# Altium schematic sheet VISHIPEL_ver1.0.SchDoc: mach_mau
size 594 x 420 mm; Author: thaipham; SheetNumber: 1; SheetTotal: 1
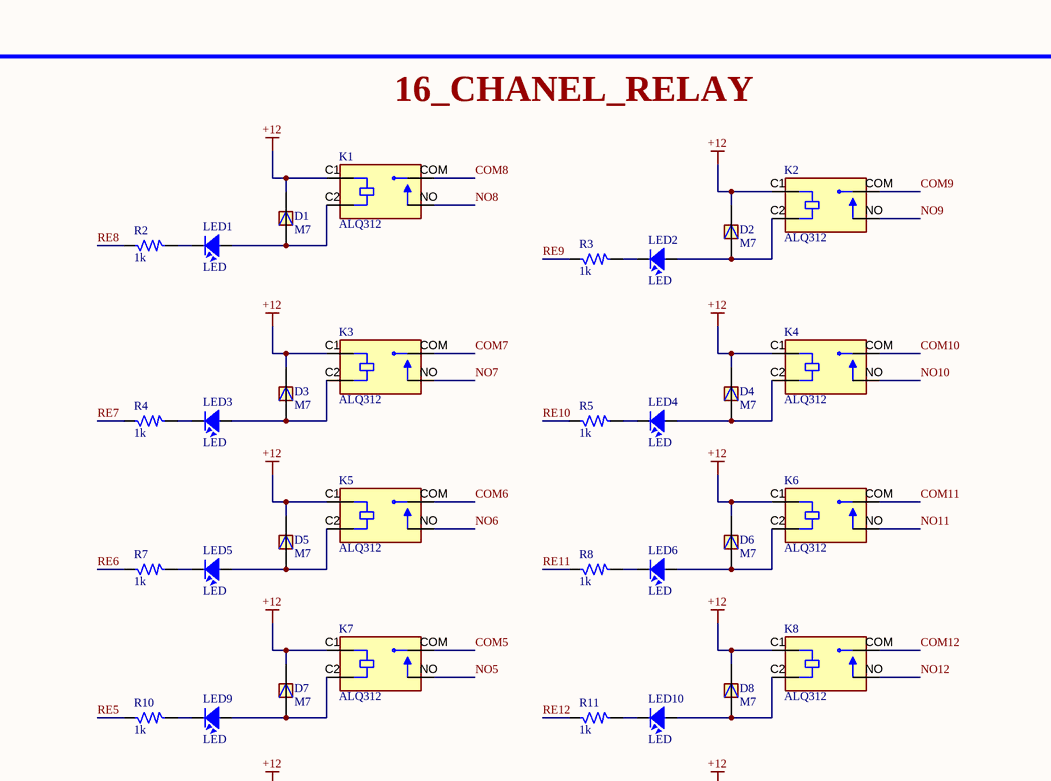
[diagram p0: VISHIPEL_ver1.0.SchDoc, top left]
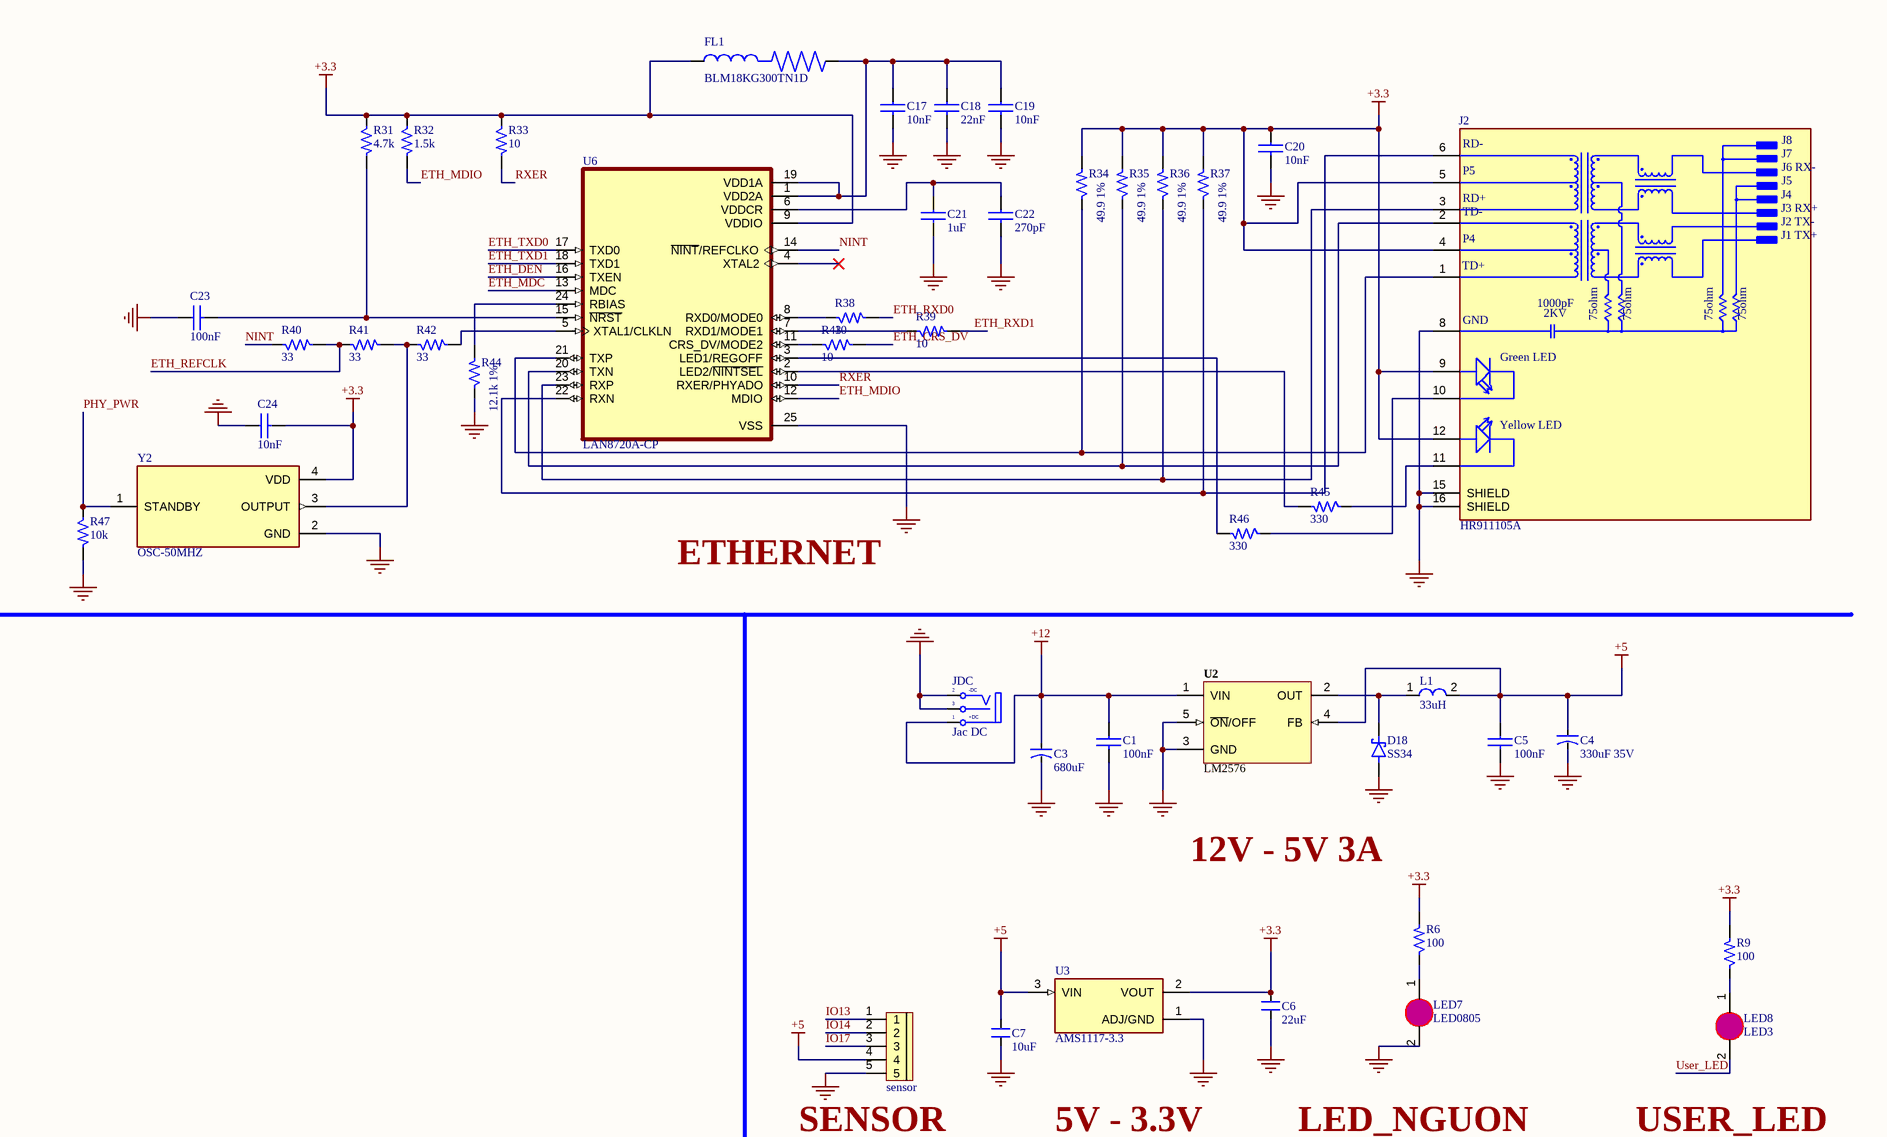
[diagram p1: VISHIPEL_ver1.0.SchDoc, top right]
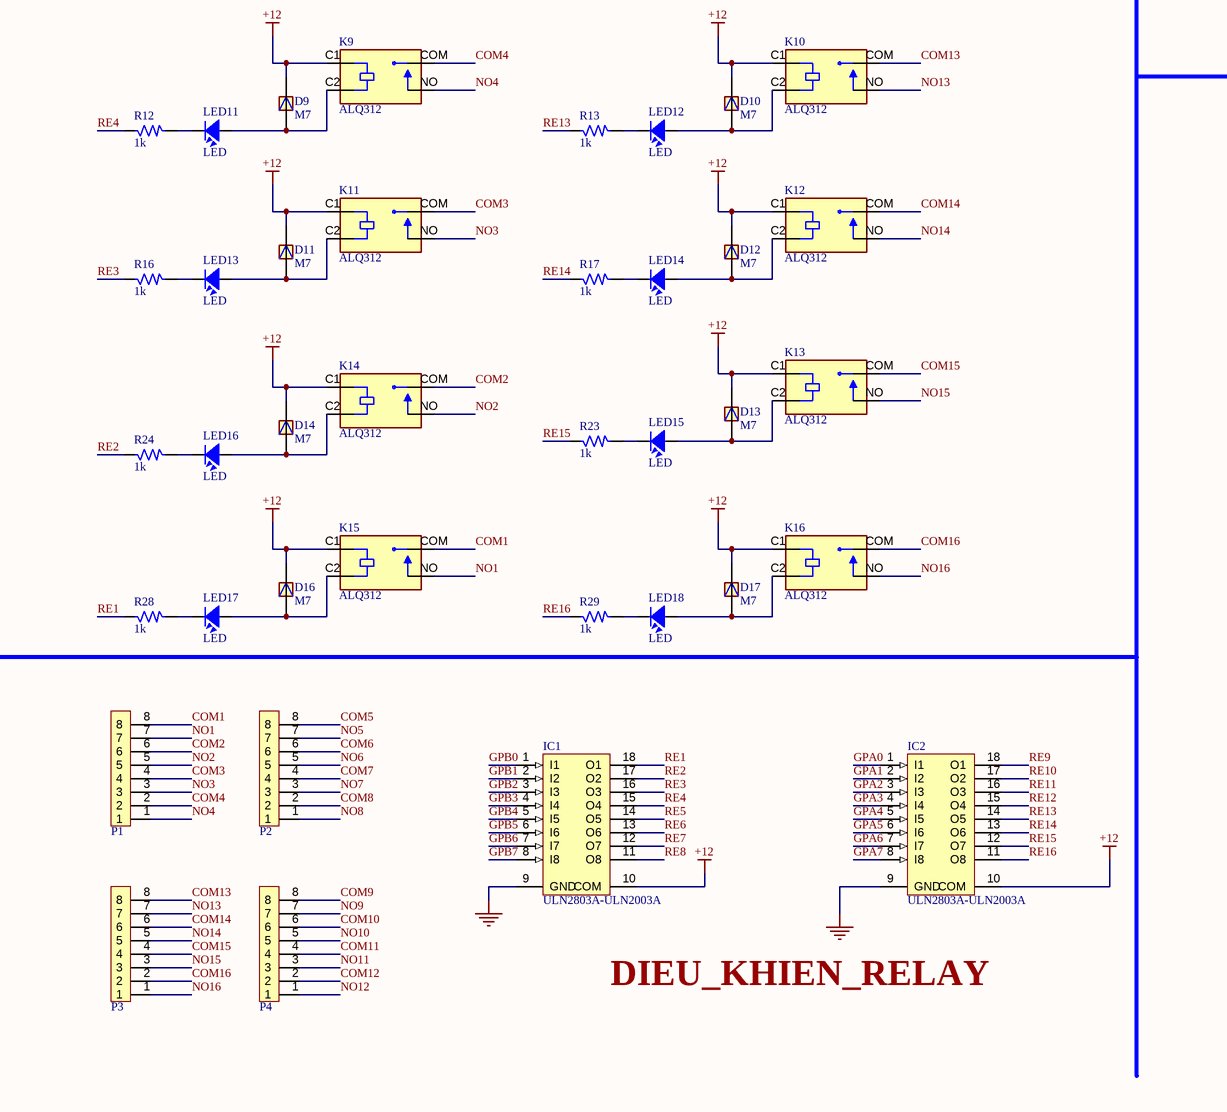
[diagram p2: VISHIPEL_ver1.0.SchDoc, bottom left]
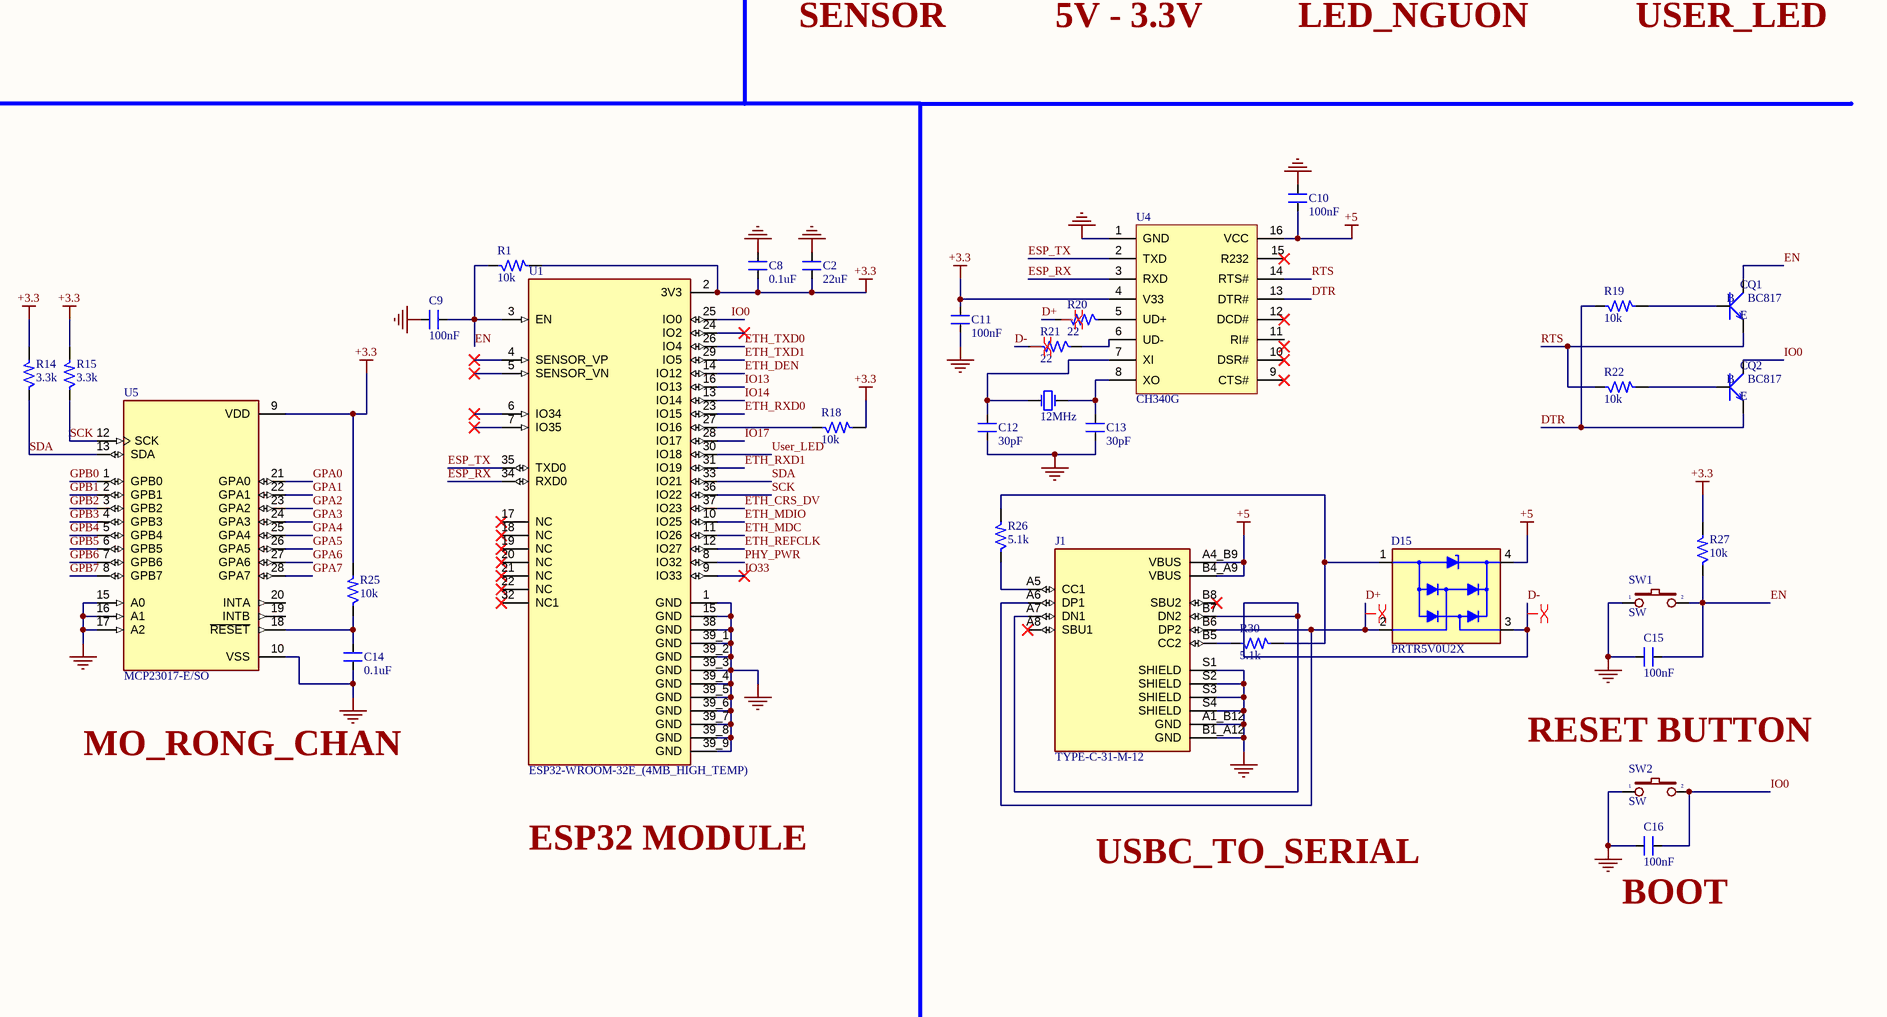
[diagram p3: VISHIPEL_ver1.0.SchDoc, bottom right]

## Parts
C1  100nF  [0805]
C2  22uF  [SM-0805]
C3  680uF  [CA-ALU-2.54]
C4  330uF 35V  [CA-ALU-2.54]
C5  100nF  [0805]
C6  22uF  [SM-0805]
C7  10uF  [SM-0805]
C8  0.1uF  [SM-0805]
C9  100nF  [SM-0805]
C10  100nF  [SM-0805]
C11  100nF  [SM-0805]
C12  30pF  [SM-0805]
C13  30pF  [SM-0805]
C14  0.1uF  [SM-0805]
C15  100nF  [SM-0805]
C16  100nF  [SM-0805]
C17  10nF  [0805]
C18  22nF  [0805]
C19  10nF  [0805]
C20  10nF  [0805]
C21  1uF  [0805]
C22  270pF  [0805]
C23  100nF  [0805]
C24  10nF  [0805]
D1  M7  [DIOM505270X240]
D2  M7  [DIOM505270X240]
D3  M7  [DIOM505270X240]
D4  M7  [DIOM505270X240]
D5  M7  [DIOM505270X240]
D6  M7  [DIOM505270X240]
D7  M7  [DIOM505270X240]
D8  M7  [DIOM505270X240]
D9  M7  [DIOM505270X240]
D10  M7  [DIOM505270X240]
D11  M7  [DIOM505270X240]
D12  M7  [DIOM505270X240]
D13  M7  [DIOM505270X240]
D14  M7  [DIOM505270X240]
D15  PRTR5V0U2X  [SOT190P230X110-4N]
D16  M7  [DIOM505270X240]
D17  M7  [DIOM505270X240]
D18  SS34  [DIOM7959X265N]
FL1  BLM18KG300TN1D  [BEADC1608X75N]
IC1  ULN2803A-ULN2003A  [SO-G16/X.6]
IC2  ULN2803A-ULN2003A  [SO-G16/X.6]
J1  TYPE-C-31-M-12  [HRO_TYPE-C-31-M-12]
J2  HR911105A  [HANRUN_HR911105A]
JDC  Jac DC  [DC-IN]
K1  ALQ312  [RELAY_ALQ312]
K2  ALQ312  [RELAY_ALQ312]
K3  ALQ312  [RELAY_ALQ312]
K4  ALQ312  [RELAY_ALQ312]
K5  ALQ312  [RELAY_ALQ312]
K6  ALQ312  [RELAY_ALQ312]
K7  ALQ312  [RELAY_ALQ312]
K8  ALQ312  [RELAY_ALQ312]
K9  ALQ312  [RELAY_ALQ312]
K10  ALQ312  [RELAY_ALQ312]
K11  ALQ312  [RELAY_ALQ312]
K12  ALQ312  [RELAY_ALQ312]
K13  ALQ312  [RELAY_ALQ312]
K14  ALQ312  [RELAY_ALQ312]
K15  ALQ312  [RELAY_ALQ312]
K16  ALQ312  [RELAY_ALQ312]
L1  33uH  [L-SMD-M-7.3x4.5]
LED1  LED  [LED-3]
LED2  LED  [LED-3]
LED3  LED  [LED-3]
LED4  LED  [LED-3]
LED5  LED  [LED-3]
LED6  LED  [LED-3]
LED7  LED0805  [LED0805]
LED8  LED3  [LED0805]
LED9  LED  [LED-3]
LED10  LED  [LED-3]
LED11  LED  [LED-3]
LED12  LED  [LED-3]
LED13  LED  [LED-3]
LED14  LED  [LED-3]
LED15  LED  [LED-3]
LED16  LED  [LED-3]
LED17  LED  [LED-3]
LED18  LED  [LED-3]
P1  BIG Heager 8  [BIG_Header 8]  (value not drawn)
P2  BIG Heager 8  [BIG_Header 8]  (value not drawn)
P3  BIG Heager 8  [BIG_Header 8]  (value not drawn)
P4  BIG Heager 8  [BIG_Header 8]  (value not drawn)
Q1  BC817  [SOT-23]
Q2  BC817  [SOT-23]
R1  10k  [SM-1206]
R2  1k  [SM-1206]
R3  1k  [SM-1206]
R4  1k  [SM-1206]
R5  1k  [SM-1206]
R6  100  [SM-1206]
R7  1k  [SM-1206]
R8  1k  [SM-1206]
R9  100  [SM-1206]
R10  1k  [SM-1206]
R11  1k  [SM-1206]
R12  1k  [SM-1206]
R13  1k  [SM-1206]
R14  3.3k  [SM-1206]
R15  3.3k  [SM-1206]
R16  1k  [SM-1206]
R17  1k  [SM-1206]
R18  10k  [SM-1206]
R19  10k  [SM-1206]
R20  22  [SM-1206]
R21  22  [SM-1206]
R22  10k  [SM-1206]
R23  1k  [SM-1206]
R24  1k  [SM-1206]
R25  10k  [SM-1206]
R26  5.1k  [SM-1206]
R27  10k  [SM-1206]
R28  1k  [SM-1206]
R29  1k  [SM-1206]
R30  5.1k  [SM-1206]
R31  4.7k  [SM-1206]
R32  1.5k  [SM-1206]
R33  10  [SM-1206]
R34  49.9 1%  [SM-1206]
R35  49.9 1%  [SM-1206]
R36  49.9 1%  [SM-1206]
R37  49.9 1%  [SM-1206]
R38  10  [SM-1206]
R39  10  [SM-1206]
R40  33  [SM-1206]
R41  33  [SM-1206]
R42  33  [SM-1206]
R43  10  [SM-1206]
R44  12.1k 1%  [SM-1206]
R45  330  [SM-1206]
R46  330  [SM-1206]
R47  10k  [SM-1206]
sensor  BIG Header 4  [BIG_Header 5]  (value not drawn)
SW1  SW  [SW2]
SW2  SW  [SW2]
U1  ESP32-WROOM-32E_(4MB_HIGH_TEMP)  [XCVR_ESP32-WROOM-32E_(4MB_HIGH_TEMP)]
U2  LM2576  [TO263]
U3  AMS1117-3.3  [SOT229P700X180-4N]
U4  CH340G  [SO-16]
U5  MCP23017-E/SO  [SOIC127P1030X265-28N]
U6  LAN8720A-CP  [QFN50P400X400X100-25N]
Y1  12MHz  [XT2]
Y2  OSC-50MHZ  [XTAL_ASEM1-50.000MHZ-LC-T]

## Nets
+3.3: C2.2 C6.2 C8.2 C11.2 C20.1 C24.2 FL1.1 J2.4(P4) J2.5(P5) J2.9(GA) J2.12(YA) R1.2 R6.2 R9.2 R14.2 R15.2 R18.2 R25.2 R27.2 R31.1 R32.1 R33.1 R34.2 R35.2 R36.2 R37.2 U1.2(3V3) U3.2(VOUT) U4.4(V33) U5.9(VDD) U6.9(VDDIO) Y2.4(VDD)
+5: C4.1 C5.1 C7.2 C10.2 D15.4(VCC) J1.A4_B9(VBUS) J1.B4_A9(VBUS) L1.2 sensor.4 U2.4(FB) U3.3(VIN) U4.16(VCC)
+12: C1.1 C3.1 D1.C D2.C D3.C D4.C D5.C D6.C D7.C D8.C D9.C D10.C D11.C D12.C D13.C D14.C D16.C D17.C IC1.10(COM) IC2.10(COM) JDC.1(T) K1.C1(COIL1) K2.C1(COIL1) K3.C1(COIL1) K4.C1(COIL1) K5.C1(COIL1) K6.C1(COIL1) K7.C1(COIL1) K8.C1(COIL1) K9.C1(COIL1) K10.C1(COIL1) K11.C1(COIL1) K12.C1(COIL1) K13.C1(COIL1) K14.C1(COIL1) K15.C1(COIL1) K16.C1(COIL1) U2.1(VIN)
GND: C1.2 C2.1 C3.2 C4.2 C5.2 C6.1 C7.1 C8.1 C9.1 C10.1 C11.1 C12.1 C13.1 C14.1 C15.1 C16.1 C17.2 C18.2 C19.2 C20.2 C21.2 C22.2 C23.1 C24.1 D18.A J1.A1_B12(GND) J1.B1_A12(GND) J1.S1(SHIELD) J1.S2(SHIELD) J1.S3(SHIELD) J1.S4(SHIELD) J2.8(GND) J2.15(SHIELD) J2.16(SHIELD) JDC.2(TN) JDC.3(S) LED7.2(K) R44.1 R47.2 sensor.5 SW1.1 SW2.1 U1.1(GND) U1.15(GND) U1.38(GND) U1.39_1(GND) U1.39_2(GND) U1.39_3(GND) U1.39_4(GND) U1.39_5(GND) U1.39_6(GND) U1.39_7(GND) U1.39_8(GND) U1.39_9(GND) U2.3(GND) U2.5(~{ON}/OFF) U3.1(ADJ/GND) U4.1(GND) U5.10(VSS) U5.15(A0) U5.16(A1) U5.17(A2) U6.25(VSS) Y2.2(GND)
NetIC1_9: IC1.9(GND) IC2.9(GND)
COM1: K15.COM P1.8
COM2: K14.COM P1.6
COM3: K11.COM P1.4
COM4: K9.COM P1.2
COM5: K7.COM P2.8
COM6: K5.COM P2.6
COM7: K3.COM P2.4
COM8: K1.COM P2.2
COM9: K2.COM P4.8
COM10: K4.COM P4.6
COM11: K6.COM P4.4
COM12: K8.COM P4.2
COM13: K10.COM P3.8
COM14: K12.COM P3.6
COM15: K13.COM P3.4
COM16: K16.COM P3.2
D+: D15.2(I/O_1) J1.A6(DP1) J1.B6(DP2) R20.2
D-: D15.3(I/O_2) J1.A7(DN1) J1.B7(DN2) R21.2
DTR: Q2.2(E) R19.1 U4.13(DTR#)
EN: C9.2 C15.2 Q1.3(C) R1.1 R27.1 SW1.2 U1.3(EN)
ESP_RX: U1.34(RXD0) U4.3(RXD)
ESP_TX: U1.35(TXD0) U4.2(TXD)
ETH_CRS_DV: R43.2 U1.37(IO23)
ETH_DEN: U1.14(IO12) U6.16(TXEN)
ETH_MDC: U1.11(IO26) U6.13(MDC)
ETH_MDIO: R32.2 U1.10(IO25) U6.12(MDIO)
ETH_REFCLK: R40.2 R41.1 U1.12(IO27)
ETH_RXD0: R38.2 U1.23(IO15)
ETH_RXD1: R39.2 U1.31(IO19)
ETH_TXD0: U1.26(IO4) U6.17(TXD0)
ETH_TXD1: U1.29(IO5) U6.18(TXD1)
GPA0: IC2.1(I1) U5.21(GPA0)
GPA1: IC2.2(I2) U5.22(GPA1)
GPA2: IC2.3(I3) U5.23(GPA2)
GPA3: IC2.4(I4) U5.24(GPA3)
GPA4: IC2.5(I5) U5.25(GPA4)
GPA5: IC2.6(I6) U5.26(GPA5)
GPA6: IC2.7(I7) U5.27(GPA6)
GPA7: IC2.8(I8) U5.28(GPA7)
GPB0: IC1.1(I1) U5.1(GPB0)
GPB1: IC1.2(I2) U5.2(GPB1)
GPB2: IC1.3(I3) U5.3(GPB2)
GPB3: IC1.4(I4) U5.4(GPB3)
GPB4: IC1.5(I5) U5.5(GPB4)
GPB5: IC1.6(I6) U5.6(GPB5)
GPB6: IC1.7(I7) U5.7(GPB6)
GPB7: IC1.8(I8) U5.8(GPB7)
IO0: C16.2 Q2.3(C) SW2.2 U1.25(IO0)
IO13: sensor.1 U1.16(IO13)
IO14: sensor.2 U1.13(IO14)
IO17: sensor.3 U1.28(IO17)
IO33: U1.9(IO33)
NINT: R40.1 U6.14(~{NINT}/REFCLKO)
NO1: K15.NO P1.7
NO2: K14.NO P1.5
NO3: K11.NO P1.3
NO4: K9.NO P1.1
NO5: K7.NO P2.7
NO6: K5.NO P2.5
NO7: K3.NO P2.3
NO8: K1.NO P2.1
NO9: K2.NO P4.7
NO10: K4.NO P4.5
NO11: K6.NO P4.3
NO12: K8.NO P4.1
NO13: K10.NO P3.7
NO14: K12.NO P3.5
NO15: K13.NO P3.3
NO16: K16.NO P3.1
PHY_PWR: R47.1 U1.8(IO32) Y2.1(STANDBY)
RE1: IC1.18(O1) R28.1
RE2: IC1.17(O2) R24.1
RE3: IC1.16(O3) R16.1
RE4: IC1.15(O4) R12.1
RE5: IC1.14(O5) R10.1
RE6: IC1.13(O6) R7.1
RE7: IC1.12(O7) R4.1
RE8: IC1.11(O8) R2.1
RE9: IC2.18(O1) R3.1
RE10: IC2.17(O2) R5.1
RE11: IC2.16(O3) R8.1
RE12: IC2.15(O4) R11.1
RE13: IC2.14(O5) R13.1
RE14: IC2.13(O6) R17.1
RE15: IC2.12(O7) R23.1
RE16: IC2.11(O8) R29.1
RTS: Q1.2(E) R22.1 U4.14(RTS#)
RXER: R33.2 U6.10(RXER/PHYADO)
SCK: R15.1 U1.36(IO22) U5.12(SCK)
SDA: R14.1 U1.33(IO21) U5.13(SDA)
User_LED: LED8.2(K) U1.30(IO18)
NetC12_2: C12.2 U4.7(XI) Y1.1(OSC1)
NetC13_2: C13.2 U4.8(XO) Y1.2(OSC2)
NetC14_2: C14.2 R25.1 U5.18(~{RESET})
NetC17_1: C17.1 C18.1 C19.1 FL1.2 U6.1(VDD2A) U6.19(VDD1A)
NetC21_1: C21.1 C22.1 U6.6(VDDCR)
NetC23_2: C23.2 R31.2 U6.15(~{NRST})
NetD1_A: D1.A K1.C2(COIL2) LED1.1
NetD2_A: D2.A K2.C2(COIL2) LED2.1
NetD3_A: D3.A K3.C2(COIL2) LED3.1
NetD4_A: D4.A K4.C2(COIL2) LED4.1
NetD5_A: D5.A K5.C2(COIL2) LED5.1
NetD6_A: D6.A K6.C2(COIL2) LED6.1
NetD7_A: D7.A K7.C2(COIL2) LED9.1
NetD8_A: D8.A K8.C2(COIL2) LED10.1
NetD9_A: D9.A K9.C2(COIL2) LED11.1
NetD10_A: D10.A K10.C2(COIL2) LED12.1
NetD11_A: D11.A K11.C2(COIL2) LED13.1
NetD12_A: D12.A K12.C2(COIL2) LED14.1
NetD13_A: D13.A K13.C2(COIL2) LED15.1
NetD14_A: D14.A K14.C2(COIL2) LED16.1
NetD15_1: D15.1(GND) R26.2 R30.2
NetD16_A: D16.A K15.C2(COIL2) LED17.1
NetD17_A: D17.A K16.C2(COIL2) LED18.1
NetD18_C: D18.C(K) L1.1 U2.2(OUT)
NetJ1_A5: J1.A5(CC1) R26.1
NetJ1_B5: J1.B5(CC2) R30.1
NetJ2_1: J2.1(TD+) R34.1 U6.21(TXP)
NetJ2_2: J2.2(TD-) R35.1 U6.20(TXN)
NetJ2_3: J2.3(RD+) R36.1 U6.23(RXP)
NetJ2_6: J2.6(RD-) R37.1 U6.22(RXN)
NetJ2_10: J2.10(GC) R46.1
NetJ2_11: J2.11(YC) R45.1
NetLED1_2: LED1.2 R2.2
NetLED2_2: LED2.2 R3.2
NetLED3_2: LED3.2 R4.2
NetLED4_2: LED4.2 R5.2
NetLED5_2: LED5.2 R7.2
NetLED6_2: LED6.2 R8.2
NetLED7_1: LED7.1(A) R6.1
NetLED8_1: LED8.1(A) R9.1
NetLED9_2: LED9.2 R10.2
NetLED10_2: LED10.2 R11.2
NetLED11_2: LED11.2 R12.2
NetLED12_2: LED12.2 R13.2
NetLED13_2: LED13.2 R16.2
NetLED14_2: LED14.2 R17.2
NetLED15_2: LED15.2 R23.2
NetLED16_2: LED16.2 R24.2
NetLED17_2: LED17.2 R28.2
NetLED18_2: LED18.2 R29.2
NetQ1_1: Q1.1(B) R19.2
NetQ2_1: Q2.1(B) R22.2
NetR18_1: R18.1 U1.27(IO16)
NetR20_1: R20.1 U4.5(UD+)
NetR21_1: R21.1 U4.6(UD-)
NetR38_1: R38.1 U6.8(RXD0/MODE0)
NetR39_1: R39.1 U6.7(RXD1/MODE1)
NetR41_2: R41.2 R42.1 Y2.3(OUTPUT)
NetR42_2: R42.2 U6.5(XTAL1/CLKLN)
NetR43_1: R43.1 U6.11(CRS_DV/MODE2)
NetR44_2: R44.2 U6.24(RBIAS)
NetR45_2: R45.2 U6.2(LED2/~{NINTSEL})
NetR46_2: R46.2 U6.3(LED1/REGOFF)

Not connected (* = marked no-connect by the designer): J1 A8(SBU1)* B8(SBU2)*; U1 4(SENSOR_VP)* 5(SENSOR_VN)* 6(IO34)* 7(IO35)* 17(NC)* 18(NC)* 19(NC)* 20(NC)* 21(NC)* 22(NC)* 24(IO2)* 32(NC1)*; U4 9(CTS#)* 10(DSR#)* 11(RI#) 12(DCD#)* 15(R232)*; U5 19(INTB) 20(INTA); U6 4(XTAL2)*

## Layout directives
differential pair: (no net found under the mark), D+, D-

## Notes on the sheet
- 16_CHANEL_RELAY
- ETHERNET
- 12V - 5V 3A
- (near sensor) SENSOR
- 5V - 3.3V
- LED_NGUON
- USER_LED
- RESET BUTTON
- MO_RONG_CHAN
- ESP32 MODULE
- USBC_TO_SERIAL
- (near C16) BOOT
- DIEU_KHIEN_RELAY
- DWG NO:
- REV:
- THIS DOCUMENT AND THE DATA DISCLOSED HEREIN OR
- HEREWITH IS THE PROPERTY OF ALTIUM LIMITED AND MAY
- BE FREELY DISTRIBUTED IN WHOLE. NO RIGHTS ARE
- RESERVED OR EXPRESS OR IMPLIED WARANTEE GIVEN.
- REVISION
- DESCRIPTION
- DATE
- APPROVED
- ENG:
- APPROVALS
- PROJECT
- DSN:
- CHK:
- REFERENCE DOCUMENTS
- PROJECT REVISION:
- TITLE
- DOCUMENT REVISION:
- DESIGN ITEM:
- BOM:
- FAB DWG:
- PCB DWG:
- ASSY DWG:
- SCALE:
- A2
- SIZE
- CAGE CODE
- FILE NAME
- DWG NO.
- SHEET
- OF
- REV
- (in symbol DCIN) -DC; +DC
- (in symbol HR911105A) J8; J7; J6 RX-; J5; J4; J3 RX+; J2 TX-; J1 TX+; 1000pF; 2KV; 75ohm; Green LED; Yellow LED

## Library data of the parts
C1 C5 C17-C24 = CAP 0805: Right: 20; Bottom: 10
C2 C6-C16 = CM: Cap SMD; Value: 103
C3 C4 = CN-ALU-DIP: Capacitor (Semiconductor SIM Model); Value: 104; LatestRevisionDate: 17-Jul-2002; LatestRevisionNote: Re-released for DXP Platform.; PackageReference: C1206; Publisher: Altium Limited
D1-D14 D16 D17 = M7: Diode, SMA, 1000V, 1A, 150Â°C; MF: Diotec Semiconductor; SnapEDA_Link: https://www.snapeda.com/parts/M7/Diotec/view-part/?ref=snap; Package: DO-214AC Diotec; Value: *; MP: M7; Check_prices: https://www.snapeda.com/parts/M7/Diotec/view-part/?ref=eda
D15 = PRTR5V0U2X: Nexperia PRTR5V0U2X,215, Dual-Element Uni-Directional TVS Diode, 4-Pin SOT-143B; MF: NXP Semiconductors; Check_prices: https://www.snapeda.com/parts/PRTR5V0U2X/NXP+Semiconductors/view-part/?ref=eda; Value: *; Purchase-URL: https://pricing.snapeda.com/search/part/PRTR5V0U2X/?ref=eda; Price: None; MP: PRTR5V0U2X; SnapEDA_Link: https://www.snapeda.com/parts/PRTR5V0U2X/NXP+Semiconductors/view-part/?ref=snap; Availability: In Stock; Package: TO-253-4 Nexperia USA Inc.
D18 = SS34: Diode Schottky 40 V 3A Surface Mount SMC (DO-214AB); MF: onsemi; SnapEDA_Link: https://www.snapeda.com/parts/SS34/Onsemi/view-part/?ref=snap; Package: SMC-2 ON Semiconductor; Value: *; MP: SS34; Check_prices: https://www.snapeda.com/parts/SS34/Onsemi/view-part/?ref=eda
FL1 = BLM18KG300TN1D: 30 Ohms @ 100MHz 1 Power Line Ferrite Bead 0603 (1608 Metric) 5A 10mOhm; MF: Murata Electronics; MP: BLM18KG300TN1D; Package: 1608 Murata; Purchase-URL: https://pricing.snapeda.com/search/part/BLM18KG300TN1D/?ref=eda; Price: None; Availability: Good; Value: *; Check_prices: https://www.snapeda.com/parts/BLM18KG300TN1D/Murata/view-part/287373/?ref=eda; SnapEDA_Link: https://www.snapeda.com/parts/BLM18KG300TN1D/Murata/view-part/287373/?ref=snap
IC1 IC2 = ULN2803A-ULN2003A: High-Voltage, High-Current Darlington Array; LatestRevisionNote: Stylized 3D Model Added.; Publisher: Altium Limited; Value: ULN2803A
J1 = TYPE-C-31-M-12: USB Connectors 24 Receptacle 1 8.94*7.3mm RoHS; MF: HRO Electronics Co., Ltd.; SnapEDA_Link: https://www.snapeda.com/parts/TYPE-C-31-M-12/HRO+Electronics+Co.%252C+Ltd./view-part/?ref=snap; Package: Package; Value: *; MP: TYPE-C-31-M-12; Check_prices: https://www.snapeda.com/parts/TYPE-C-31-M-12/HRO+Electronics+Co.%252C+Ltd./view-part/?ref=eda
J2 = HR911105A: DIP RJ45 Connector;; MF: hanrun; SnapEDA_Link: https://www.snapeda.com/parts/HR911105A/HanRun/view-part/?ref=snap; Package: None; MP: HR911105A; Check_prices: https://www.snapeda.com/parts/HR911105A/HanRun/view-part/?ref=eda; Price: None; Value: *; Availability: Not in stock
JDC = DCIN: Jac DC input; Value: Jac DC
K1-K16 = ALQ312: General Purpose Relay SPST-NO (1 Form A) 12VDC Coil Through Hole; MF: Panasonic Electric; Package: DIP-4; Price: None; Value: *; SnapEDA_Link: https://www.snapeda.com/parts/ALQ312/Panasonic+Electric+Works/view-part/?ref=snap; MP: ALQ312; Availability: Unavailable; Check_prices: https://www.snapeda.com/parts/ALQ312/Panasonic+Electric+Works/view-part/?ref=eda
L1 = L-SMD-1: partNo: 78477010; Manufacturer: Wurth Elektronik; Inductance: 1.0 μH; ComponentLink1Description: Manufacturer; ComponentLink1URL: http://www.we-online.de; Created by: Baojun Chen; Created Date: Nov.2015; ComponentLink2Description: Datasheet; ComponentLink2URL: http://katalog.we-online.de/pbs/datasheet/78477010.pdf
LED1-LED6 LED9-LED18 = LED: LED Single colour Green and Red; Value: LED 3 ly Single Colour
LED7 LED8 = LEDSMD: LED 3mm
P1-P4 = BIG_Header 8
Q1 Q2 = TRANSISTOR-NPN*: Bipolar (BJT) Transistor NPN 45V 500mA 100MHz 250mW Surface Mount TO-236AB; MF: STMicroelectronics; MP: BC817-40; SnapEDA_Link: https://www.snapeda.com/parts/BC817-40/STMicroelectronics/view-part/?ref=snap; Package: SOT-23 Diodes Inc.; Value: *; Check_prices: https://www.snapeda.com/parts/BC817-40/STMicroelectronics/view-part/?ref=eda
R1-R47 = Res: Resistor 1/4W; Value: R1/4W - 1K
sensor = BIG_Header 5
SW1 SW2 = SW2: Switch button 2 pin; Value: SW chip 2 pin
U1 = ESP32-WROOM-32E_(4MB_HIGH_TEMP): Bluetooth, WiFi 802.11b/g/n, Bluetooth v4.2 +EDR, Class 1, 2 and 3 Transceiver Module 2.4GHz ~ 2.5GHz Integrated, Trace Surface Mount; MF: Espressif Systems; MP: ESP32-WROOM-32E (4MB HIGH TEMP); Package: SMD-44 Espressif Systems; Check_prices: https://www.snapeda.com/parts/ESP32-WROOM-32E%20(4MB%20HIGH%20TEMP)/Espressif+Systems/view-part/?ref=eda; Value: *; Price: None; Purchase-URL: https://pricing.snapeda.com/search/part/ESP32-WROOM-32E (4MB HIGH TEMP)/?ref=eda; SnapEDA_Link: https://www.snapeda.com/parts/ESP32-WROOM-32E%20(4MB%20HIGH%20TEMP)/Espressif+Systems/view-part/?ref=snap; Availability: In Stock
U2 = LM2576: Max Input Voltage: 12 V; Max Output Current: 3 (6.0 peak) A; Max Output Voltage: mV; Category: IC-Power; Min Input Voltage: mV; Min Output Voltage: mV; Mounting Technology: Surface Mount; Status: Unreleased; Supply Voltage: mV; Temperature Range: -40 to +125 degC
U3 = AMS1117-3.3: Linear Voltage Regulator IC Positive Fixed 1 Output 1A SOT-223-3L; MF: UMW; SnapEDA_Link: https://www.snapeda.com/parts/AMS1117-3.3/UMW/view-part/?ref=snap; Package: SOT-223-3L UMW; Value: *; MP: AMS1117-3.3; Check_prices: https://www.snapeda.com/parts/AMS1117-3.3/UMW/view-part/?ref=eda
U4 = CH340G: USB<->UART
U5 = MCP23017-E/SO: I/O Port Expander, 16-Bit, I2C I'face, SOIC-28 | Microchip Technology Inc. MCP23017-E/SO; SnapEDA_Link: https://www.snapeda.com/parts/MCP23017-E/SO/Microchip/view-part/?ref=snap; Package: SOIC-28 Microchip; Value: *; MF: Microchip; MP: MCP23017-E/SO; Check_prices: https://www.snapeda.com/parts/MCP23017-E/SO/Microchip/view-part/?ref=eda
U6 = LAN8720A-CP: PHY 1-CH 10Mbps/100Mbps 2.5V/3.3V 24-Pin VQFN EP Tray; MF: Microchip Technology; SnapEDA_Link: https://www.snapeda.com/parts/LAN8720A-CP/Microchip/view-part/?ref=snap; Package: VFQFN-24 Microchip Technology; Value: *; MP: LAN8720A-CP; Check_prices: https://www.snapeda.com/parts/LAN8720A-CP/Microchip/view-part/?ref=eda
Y1 = Crystal: Crystal Oscillator; Published: 8-Jun-2000; LatestRevisionDate: 17-Jul-2002; LatestRevisionNote: Re-released for DXP Platform.; PackageReference: R38; Publisher: Altium Limited
Y2 = ASEM1-50.000MHZ-LC-T: 50 MHz XO (Standard) CMOS Oscillator 3.3V Standby (Power Down) 4-SMD, No Lead; MF: Abracon LLC; SnapEDA_Link: https://www.snapeda.com/parts/ASEM1-50.000MHZ-LC-T/Abracon/view-part/?ref=snap; Package: NON STANDARD Abracon; Value: *; MP: ASEM1-50.000MHZ-LC-T; Check_prices: https://www.snapeda.com/parts/ASEM1-50.000MHZ-LC-T/Abracon/view-part/?ref=eda